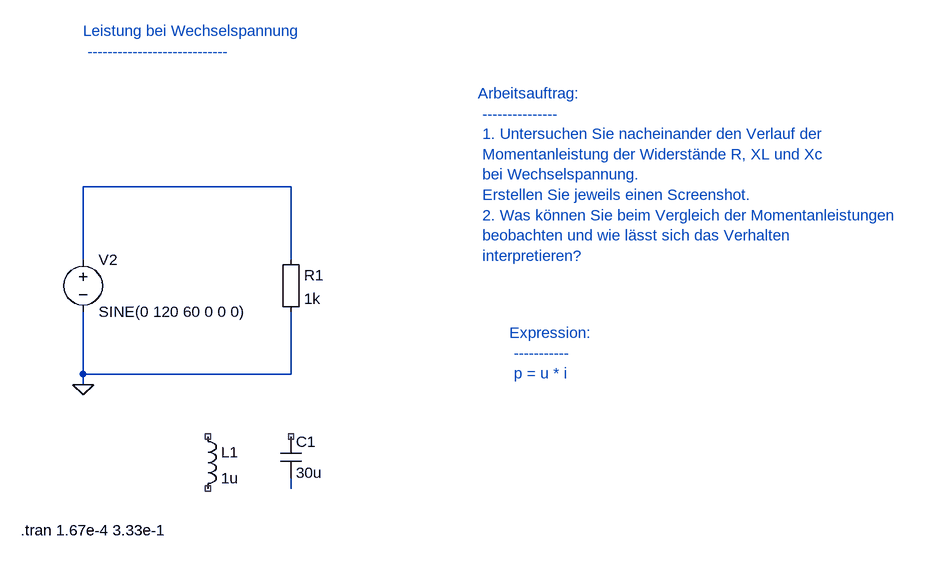
[diagram p0: schematic 11_4_1_Leistung_an_Wechselspannung.asc]
11_4_1_Leistung_an_Wechselspannung.asc, the LTspice schematic file:
Version 4
SHEET 1 880 680
WIRE 160 512 160 528
WIRE 480 768 480 784
WIRE 160 528 160 608
WIRE 480 432 480 320
WIRE 480 320 160 320
WIRE 160 320 160 432
WIRE 160 608 160 624
WIRE 480 512 480 608
WIRE 480 608 160 608
FLAG 160 624 0
SYMBOL ind 336 688 R0
SYMATTR InstName L1
SYMATTR Value 1u
SYMBOL voltage 160 416 R0
SYMATTR InstName V2
SYMATTR Value SINE(0 120 60 0 0 0)
SYMBOL cap 464 704 R0
SYMATTR InstName C1
SYMATTR Value 30u
SYMBOL Misc\EuropeanResistor 464 416 R0
SYMATTR InstName R1
SYMATTR Value 1k
TEXT 64 848 Left 2 !.tran 1.67e-4 3.33e-1
TEXT 160 80 Left 2 ;Leistung bei Wechselspannung \n ----------------------------
TEXT 768 176 Left 2 ;Arbeitsauftrag: \n --------------- \n 1. Untersuchen Sie nacheinander den Verlauf der \n Momentanleistung der Widerstände R, XL und Xc \n bei Wechselspannung. \n Erstellen Sie jeweils einen Screenshot. \n 2. Was können Sie beim Vergleich der Momentanleistungen \n beobachten und wie lässt sich das Verhalten \n interpretieren?
TEXT 816 544 Left 2 ;Expression: \n ----------- \n p = u * i

The netlist it stands for:
* 11_4_1_Leistung_an_Wechselspannung.asc
L1 NC_01 NC_02 1u
V2 N002 0 SINE(0 120 60 0 0 0)
C1 NC_03 N001 30u
R1 N002 0 1k
.tran 1.67e-4 3.33e-1
* Leistung bei Wechselspannung
*  ----------------------------
* Arbeitsauftrag:
*  ---------------
*  1. Untersuchen Sie nacheinander den Verlauf der
*  Momentanleistung der Widerstände R, XL und Xc
*  bei Wechselspannung.
*  Erstellen Sie jeweils einen Screenshot.
*  2. Was können Sie beim Vergleich der Momentanleistungen
*  beobachten und wie lässt sich das Verhalten
*  interpretieren?
* Expression:
*  -----------
*  p = u * i
.backanno
.end